# Altium schematic sheet QCopterMV_USB_Sch.SchDoc
size A4
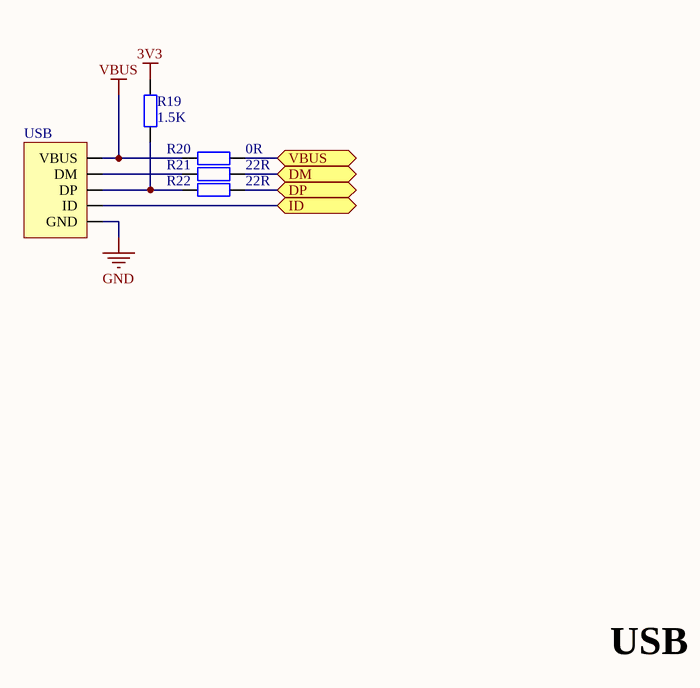
[diagram p0: QCopterMV_USB_Sch.SchDoc]

## Parts
R19  value 1.5K  [RES_0603]  (hidden comment: Res_0603)
R20  value 0R  [RES_0603]  (hidden comment: Res_0603)
R21  value 22R  [RES_0603]  (hidden comment: Res_0603)
R22  value 22R  [RES_0603]  (hidden comment: Res_0603)
USB  USB_Micro  [USB_MICRO_B]  (value not drawn)

## Ports
DM, DP, ID, VBUS

## Nets
3V3: R19.2
GND: USB.5(GND)
VBUS: R20.1 USB.1(VBUS)
DM: R21.2 ; port DM
DP: R22.2 ; port DP
ID: USB.4(ID) ; port ID
VBUS: R20.2 ; port VBUS  [a separate net that carries the same name]
NetR19_1: R19.1 R22.1 USB.3(DP)
NetR21_1: R21.1 USB.2(DM)

## Notes on the sheet
- USB

## Library data of the parts
R19-R22 = Res_0603: Resistor
USB = USB_Micro: USB